# Altium project Task 6.PrjPcb
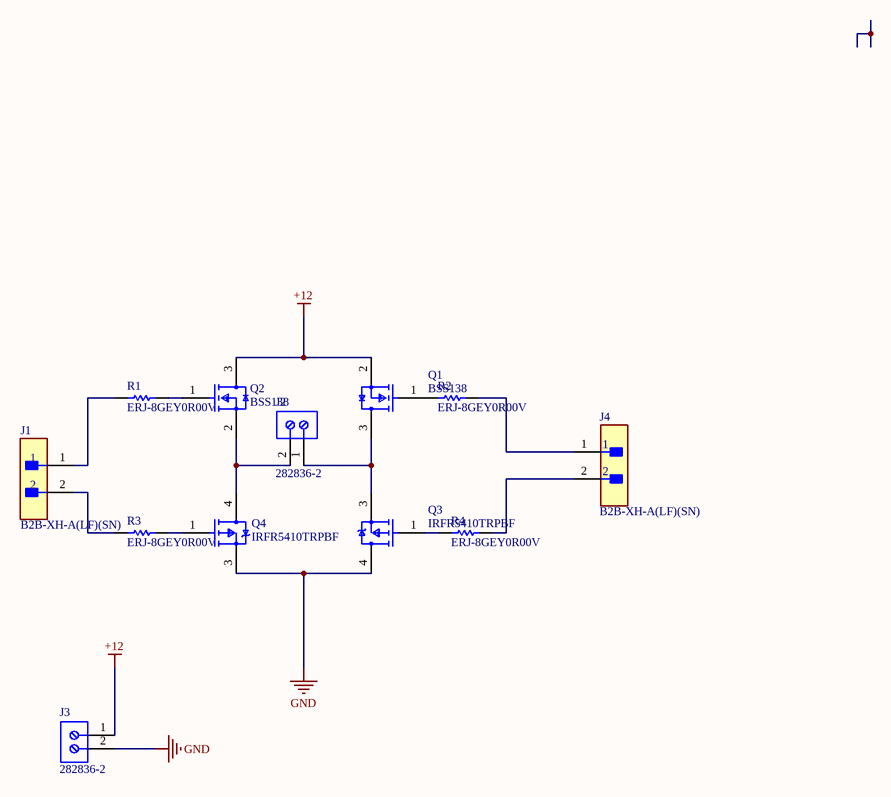
[diagram p0: Sheet1.SchDoc]
1 sheet, 12 parts. Net scope: global (net labels, ports and power ports of the same name join across sheets).

## Sheet Sheet1.SchDoc
size A4; SheetNumber: 1; SheetTotal: 1

### Parts
J1  B2B-XH-A(LF)(SN)  [FP-B2B-XH-A_LF_SN-MFG]
J2  282836-2  [TECO-282836-2_V]
J3  282836-2  [TECO-282836-2_V]
J4  B2B-XH-A(LF)(SN)  [FP-B2B-XH-A_LF_SN-MFG]
Q1  BSS138  [FP-318-08-IPC_B]
Q2  BSS138  [FP-318-08-IPC_B]
Q3  IRFR5410TRPBF  [FP-PG-TO252-3-MFG]
Q4  IRFR5410TRPBF  [FP-PG-TO252-3-MFG]
R1  ERJ-8GEY0R00V  [RESC3216X70X50NL05T20]
R2  ERJ-8GEY0R00V  [RESC3216X70X50NL05T20]
R3  ERJ-8GEY0R00V  [RESC3216X70X50NL05T20]
R4  ERJ-8GEY0R00V  [RESC3216X70X50NL05T20]

### Nets
+12: J3.1 Q1.2(S) Q2.3(D)
GND: J3.2 Q3.4(D) Q4.3(S)
NetJ1_1: J1.1 R1.1
NetJ1_2: J1.2 R3.1
NetJ2_1: J2.1 Q1.3(D) Q3.3(S)
NetJ2_2: J2.2 Q2.2(S) Q4.4(D)
NetJ4_1: J4.1 R2.2
NetJ4_2: J4.2 R4.2
NetQ1_1: Q1.1(G) R2.1
NetQ2_1: Q2.1(G) R1.2
NetQ3_1: Q3.1(G) R4.1
NetQ4_1: Q4.1(G) R3.2

### Library data of the parts
J1 J4 = CMP-2000-05888-3: CONN HEADER VERT 2POS 2.5MM; Current Rating: 3A; Voltage Rating: 250V; Number of Contacts: 2; Contact Resistance: 20mR; Wire/Cable Gauge: 22AWG; Insulation Resistance: 1GR; Connector Type: Male Pin; Packaging: Bulk; Contact Material: Brass; Lead Free: Lead Free; Orientation: Straight; Contact Plating: Tin; Max Current Rating: 3A; Termination: Solder; Fastening Type: Detent; Depth: 5.75mm; Housing Material: Polyamide; REACH SVHC: No SVHC; Series: XH; Voltage Rating (AC): 250V; Number of Positions: 2; Color: Natural; Contact Type: Male Pin; Max Voltage Rating (DC): 250V; Pitch: 2.5mm; Lead Pitch: 2.5mm; Mount: Through Hole; Max Operating Temperature: 85°C; Length: 7.4mm; Max Voltage Rating (AC): 250V; Min Operating Temperature: -25°C; Number of Rows: 1; Housing Color: White
J2 J3 = CMP-1684-00017-1: Female Header, Pitch 5 mm, 1 x 2 Position, Height 10 mm, Tail Length 3.5 mm, Rohs, Bulk; Manufacturer: TE Connectivity; Wire Gauge: 16-30AWG; Product Training Modules: Wire-to-BoardEurostyleTerminalBlocks; Clamp Material - Plating: Brass-NickelPlated; Voltage: 300V; Mating Orientation: HorizontalwithBoard; Current: 13.5A; Pitch: 0.197"(5.00mm); Screw Thread: M3; 3D Model: 282836-2.pdf; Other Names: 5ULV-02B / A98076; Dynamic Catalog: BuchananSeries; Number of Levels: 1; Torque - Screw: 0.68Nm(6Lb-In); Featured Product: EurostyleTerminalBlockConnectors; Positions Per Level: 2; Wire Termination: Screw-RisingCageClamp; Datasheet URL: http://www.te.com.cn/commerce/DocumentDelivery/DDEController?Action=showdoc&DocId=Catalog+Section%7F1308389_EUROSTYLE_TERMINAL_BLOCKS%7F0607%7Fpdf%7FEnglish%7FENG_CS_1308389_EUROSTYLE_TERMINAL_BLOCKS_0607.pdf%7F282836-2; Color: Green; Family: TerminalBlocks-WiretoBoard; RoHS Information: 282836-2StatementofCompliance; Standard Package: 300; Contact Material - Plating: Brass-TinPlated; Manufacturer URL: http://www.te.com; Housing Material: Polyamide(PA66),Nylon6/6; Features: Interlocking(Side); Package Description: Female Header, Pitch 5 mm, 1 x 2 Position, Height 10 mm, Tail Length 3.5 mm; Mounting Type: ThroughHole; Package Reference: THD; Packaging: Bulk; Series: Buchanan; Category: Connectors,Interconnects; Screw Material - Plating: Brass-NickelPlated
Q1 Q2 = CMP-07173-000101-1: MOSFET N-CH 50V 220MA SOT-23; Turn-Off Delay Time: 20ns; Element Configuration: Single; Rds On Max: 3.5R; Gate to Source Voltage (Vgs): 20V; Threshold Voltage: 1.3V; Number of Elements: 1; Power Dissipation: 360mW; Rise Time: 9ns; Turn-On Delay Time: 2.5ns; Input Capacitance: 27pF; On-State Resistance: 6R; Lead Free: Lead Free; Length: 2.92mm; Width: 1.3mm; Drain to Source Breakdown Voltage: 50V; Min Operating Temperature: -55°C; REACH SVHC: No SVHC; Packaging: Tape and Reel; Radiation Hardening: No; Height: 0.93mm; Drain to Source Voltage (Vdss): 50V; Current Rating: 220mA; Voltage Rating (DC): 50V; Weight: 0.03g; Continuous Drain Current (ID): 220mA; Number of Pins: 3; Nominal Vgs: 1.3V; Max Power Dissipation: 360mW; Fall Time: 9ns; Drain to Source Resistance: 3.5R; Contact Plating: Tin; Case/Package: SOT-23; Package Quantity: 1; Dual Supply Voltage: 50V; Mount: Surface Mount; Termination: SMD/SMT; Max Operating Temperature: 150°C
Q3 Q4 = CMP-32901-000090-1: MOSFET P-CH 100V 13A DPAK; Manufacturer: Infineon; Threshold Vgs Min: -2V; Pulse Drain Current: -52A; Max Junction Temp: +150°C; Drain To Source Voltage: -100V; Max Forward Diode Voltage: -1.6V; Power Dissipation: 66W; Turn On Delay Time: 15ns; Input Capacitace At Vds: 760pF @ -25V; Rthja Max: 50°C/W; Depletion Mode: False; Number Of P Channels: 1; Reverse Recovery Time: 130ns; Continuous Drain Current: -13A; Drain To Source Resistance: 0.205Ω; Threshold Vgs Max: -4V; Reverse Recovery Charge: 650nC; Gate To Source Voltage: 20V; Gate Charge At Vgs: 58nC @ -10V; Turn Off Delay Time: 45ns; Temperature: -55°C to +150°C; Package: PG-TO252-3; Category: Trans; Footprint Url: http://www.irf.com/package/hexfet/dpakfootprint.pdf; Temperature Range Low: -55°C; Temperature Range High: +150°C; Automotive: No; Device Class L3: MOSFETs; Digikey Description: MOSFET P-CH 100V 13A DPAK; ComponentLink2URL: https://www.infineon.com/dgdl/irfr5410pbf.pdf?fileId=5546d462533600a4015356356f622107; Octopart: https://octopart.com/irfr5410trpbf-infineon-65874169; Device Class L2: Transistors; Lead Free: Yes; Manufacturer Part Number: IRFR5410TRPBF; ComponentLink2Description: Datasheet; Height: 2.52mm; Number Of Channels: 1; Drain To Source Breakdown Voltage: -100V; Device Class L1: Discrete Semiconductors; RoHS: TRUE
R1-R4 = CMP-2003-00541-1: Manufacturer: Panasonic; Part Number: ERJ-8GEY0R00V